# Altium schematic sheet 6 Power.SchDoc
size A
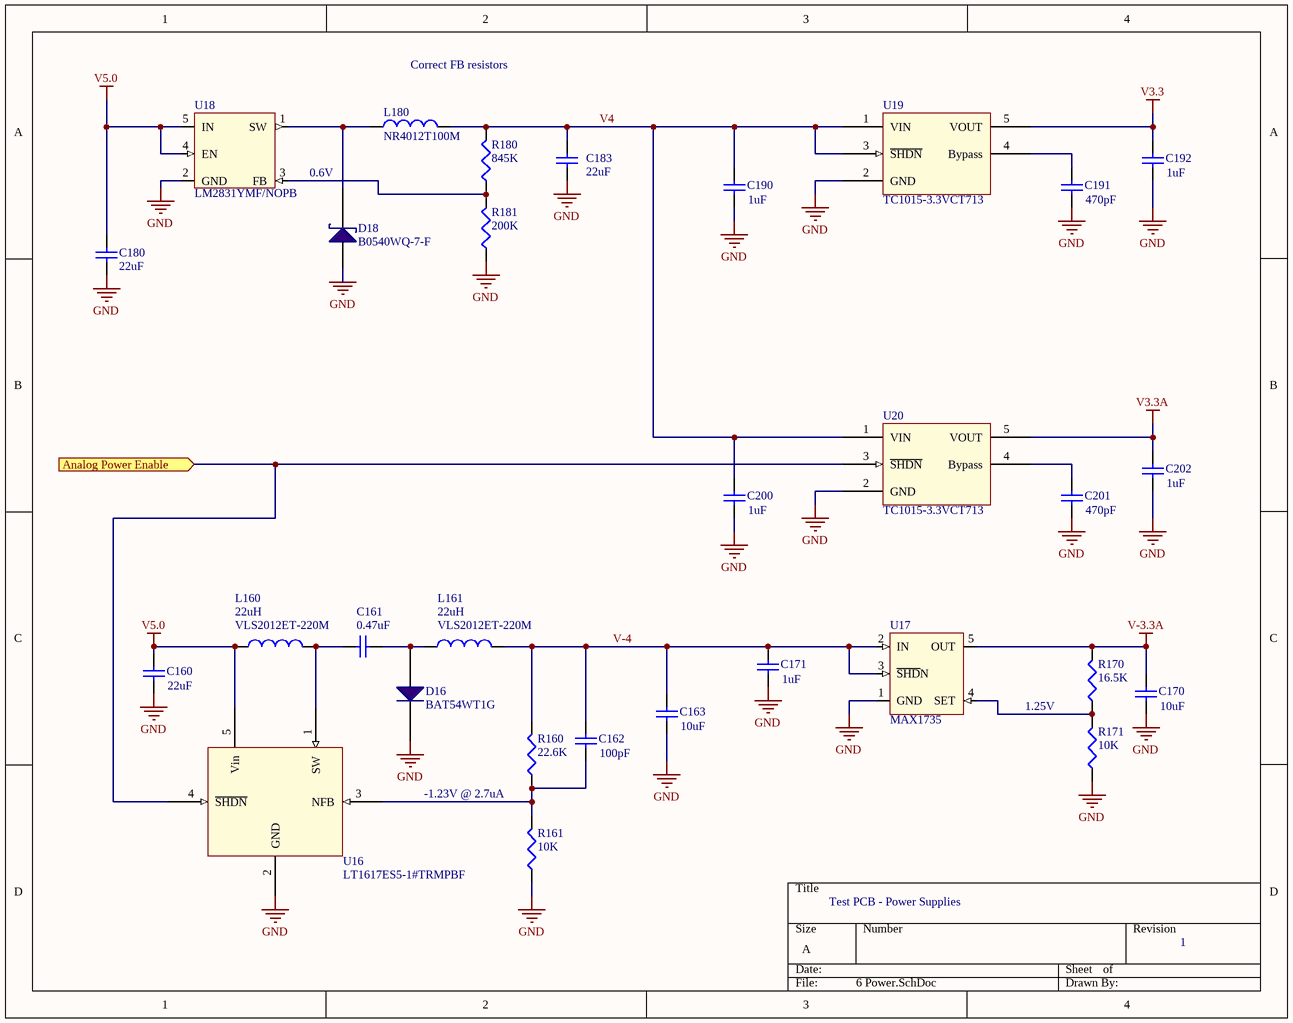
[diagram p0: 6 Power.SchDoc]

## Parts
C160  22uF  [C0805]
C161  0.47uF  [C0603]
C162  100pF  [C0603]
C163  10uF  [C0805]
C170  10uF  [C0805]
C171  1uF  [C0603]
C180  22uF  [C0805]
C183  22uF  [C0805]
C190  1uF  [C0603]
C191  470pF  [C0603]
C192  1uF  [C0603]
C200  1uF  [C0603]
C201  470pF  [C0603]
C202  1uF  [C0603]
D16  BAT54WT1G  [SC70-3]
D18  B0540WQ-7-F  [SOD123W]
L160  VLS2012ET-220M  value 22uH  [L_2012]
L161  VLS2012ET-220M  value 22uH  [L_2012]
L180  NR4012T100M  [L_4018]
R160  22.6K  [R0603]
R161  10K  [R0603]
R170  16.5K  [R0603]
R171  10K  [R0603]
R180  845K  [R0603]
R181  200K  [R0603]
U16  LT1617ES5-1#TRMPBF  [SOT23-5]
U17  MAX1735  [SOT23-5]
U18  LM2831YMF/NOPB  [SOT23-5]
U19  TC1015-3.3VCT713  [SOT23-5]
U20  TC1015-3.3VCT713  [SOT23-5]

## Ports
Analog Power Enable (in)

## Nets
GND: C160.1 C163.1 C170.1 C171.1 C180.1 C183.1 C190.1 C191.1 C192.1 C200.1 C201.1 C202.1 D16.3 D18.1 R161.1 R171.1 R181.1 U16.2(GND) U17.1(GND) U18.2(GND) U19.2(GND) U20.2(GND)
V3.3: C192.2 U19.5(VOUT)
V3.3A: C202.2 U20.5(VOUT)
V5.0: C160.2 C180.2 L160.1 U16.5(Vin) U18.4(EN) U18.5(IN)
V-3.3A: C170.2 R170.2 U17.5(OUT)
Analog Power Enable: U16.4(~{SHDN}) U20.3(~{SHDN}) ; port Analog Power Enable
V4: C183.2 C190.2 C200.2 L180.2 R180.2 U19.1(VIN) U19.3(~{SHDN}) U20.1(VIN)
V-4: C162.2 C163.2 C171.2 L161.2 R160.2 U17.2(IN) U17.3(~{SHD}N)
NetC161_1: C161.1 L160.2 U16.1(SW)
NetC161_2: C161.2 D16.1 L161.1
NetC162_1: C162.1 R160.1 R161.2 U16.3(NFB)
NetC191_2: C191.2 U19.4(Bypass)
NetC201_2: C201.2 U20.4(Bypass)
NetD18_2: D18.2 L180.1 U18.1(SW)
NetR170_1: R170.1 R171.2 U17.4(SET)
NetR180_1: R180.1 R181.2 U18.3(FB)

## Notes on the sheet
- Correct FB resistors
- 0.6V
- 1.25V
- -1.23V @ 2.7uA
- Test PCB - Power Supplies
- 1

## Library data of the parts
C160-C163 C170 C171 C180 C183 C190-C192 C200-C202 = Cap SM: Capacitor, SM; Published: 8-Jun-2000; LatestRevisionDate: 29-May-2009; LatestRevisionNote: IPC-7351 Footprint Added.; PackageReference: C1206; Publisher: Altium Limited; PackageDescription: Chip Capacitor
  C160 C180 C183: Value: 22uF
  C161: Value: 0.47uF
  C162: Value: 100pF
  C163 C170: Value: 10uF
  C171 C190 C192 C200 C202: Value: 1uF
  C191 C201: Value: 470pF
D16 = BAT54W
D18 = BAT46W: Schottky diode
L160 L161 L180 = Inductor
R160 R161 R170 R171 R180 R181 = Res SM: Resistor; Published: 8-Jun-2000; LatestRevisionDate: 29-May-2009; LatestRevisionNote: IPC-7351 Footprint Added.; PackageReference: J1-0603; Publisher: Altium Limited; PackageDescription: Chip Resistor
  R160: Value: 22.6K
  R161 R171: Value: 10K
  R170: Value: 16.5K
  R180: Value: 845K
  R181: Value: 200K
U16 = LT1617-1
U18 = LM2831
U19 U20 = TC1014